# EAGLE schematic what-the-frequency-mk-4 (EAGLE 6.4)
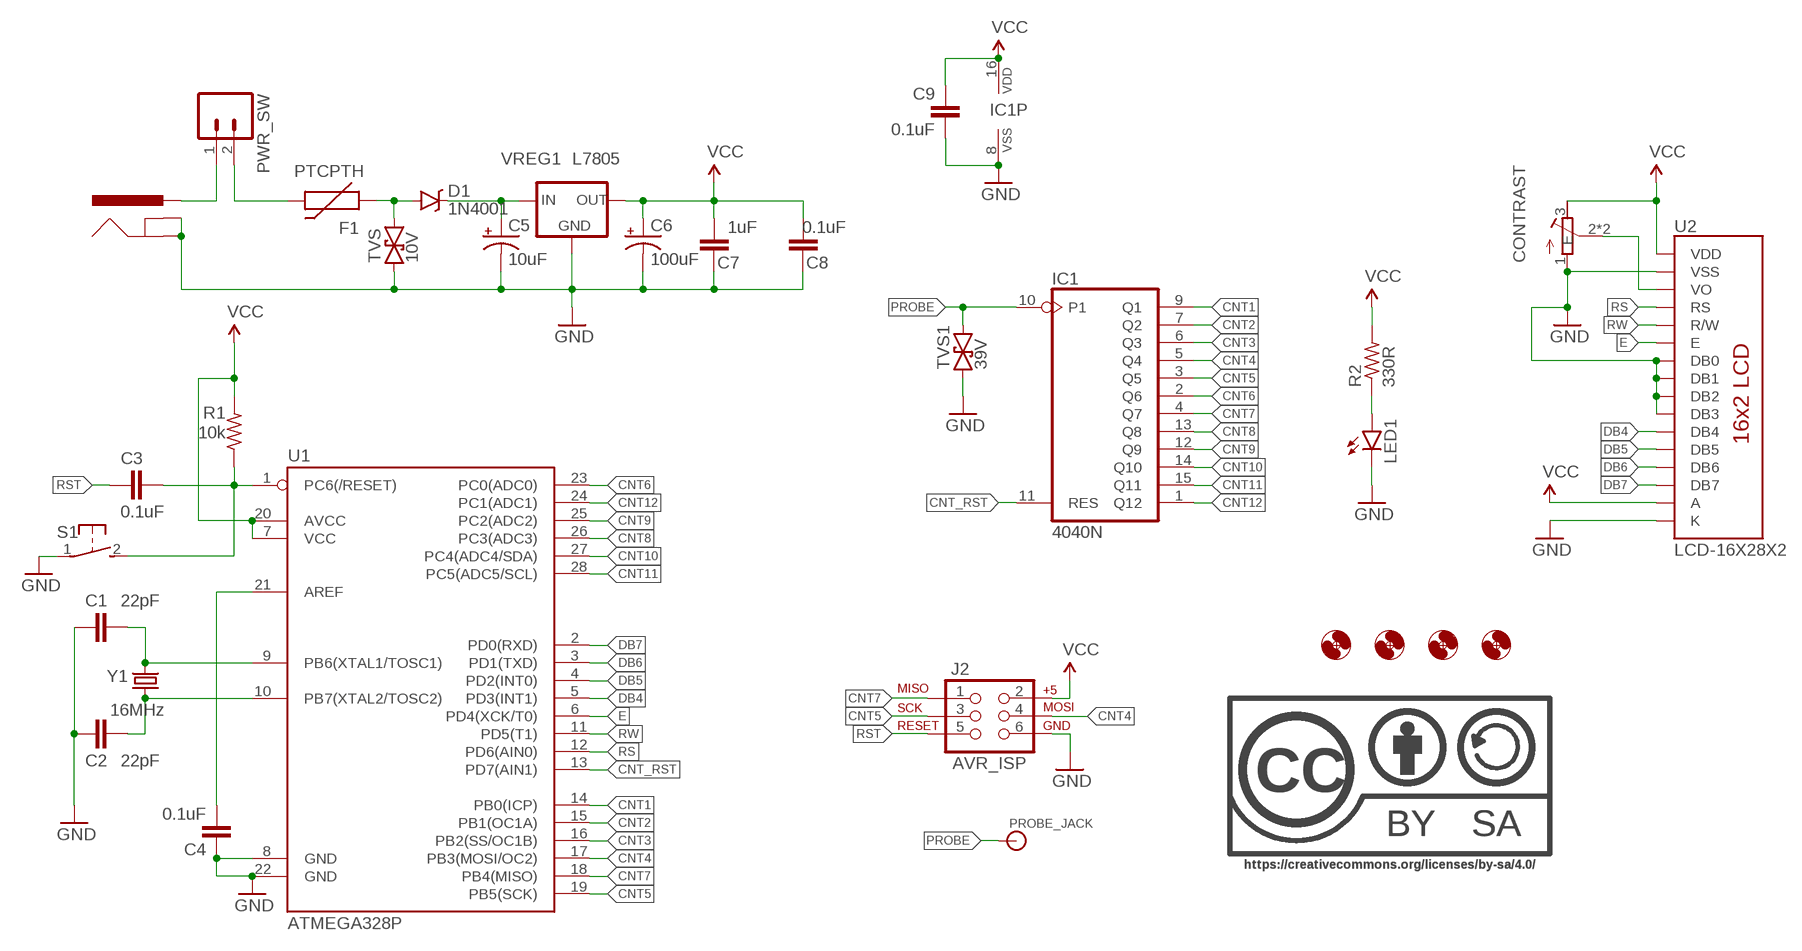
[diagram p0: schematic, sheet 1]

## Parts
C1  22pF  CAPACITOR-CERAMIC025-024X044  [C025-024X044]
C2  22pF  CAPACITOR-CERAMIC025-024X044  [C025-024X044]
C3  0.1uF  CAPACITOR-CERAMIC025-024X044  [C025-024X044]
C4  0.1uF  CAPACITOR-CERAMIC025-024X044  [C025-024X044]
C5  10uF  CAPACITOR-POLARIZEDE2-5  [E2-5]
C6  100uF  CAPACITOR-POLARIZEDE2.5-6  [E2,5-6]
C7  1uF  CAPACITOR-CERAMIC025-024X044  [C025-024X044]
C8  0.1uF  CAPACITOR-CERAMIC025-024X044  [C025-024X044]
C9  0.1uF  CAPACITOR-CERAMIC025-024X044  [C025-024X044]
CONTRAST  POTENTIOMETERTHUMBWHEEL-16MM  [POT-THUMBWHEEL]
D1  1N4001  DIODE-SCHOTTKYDO-41  [DO-41]
F1  PTCPTH  [PTC]
H1  HOLE#4  [HOLE-#4]
H2  HOLE#4  [HOLE-#4]
H3  HOLE#4  [HOLE-#4]
H4  HOLE#4  [HOLE-#4]
IC1  4040N  [DIL16]
J1  POWER_JACKPTH  [POWER_JACK_PTH]
J2  AVR_ISP  AVR_SPI_PRG_6INLINE  [AVR_MINI_PROG]
LED1  LED3MM  [LED3MM]
PROBE_JACK  BANANA_CONNPTH-RA  [BANANA-PTH-RA-SAFEWORD]
PWR_SW  M02PTH  [1X02]
R1  10k  RESISTORAXIAL-PTH-7.68MM  [RESISTOR-AXIAL-PTH-7.68MM]
R2  330R  RESISTORPTH-AXIAL-5.08MM  [RESISTOR-AXIAL-PTH-5.08MM]
S1  DTS-3  [DTS-3]
TVS  10V  TVSDO-41-TVS-BIDIRECTIONAL  [DO-41-TVS]
TVS1  39V  TVSDO-41-TVS-BIDIRECTIONAL  [DO-41-TVS]
U1  ATMEGA328P  ATMEGA328P_PDIP  [DIL28-3]
U2  LCD-16X28X2  [LCD-8X2]
U$3  CC-BY-SA-4.0URL-BOTTOM  [CC-BY-SA-4.0-URL-BOTTOM]
U$7  CC-BY-SA-4.0NO-URL  [CC-BY-SA-4.0-NO-URL]
VREG1  L7805  V_REG_78XXTO-92-INLINE  [TO-92-AMMO]
Y1  16MHz  CRYSTALHC49UV  [HC49U-V]

## Nets
CNT1: IC1.9(Q1) U1.14(PB0(ICP))
CNT2: IC1.7(Q2) U1.15(PB1(OC1A))
CNT3: IC1.6(Q3) U1.16(PB2(SS/OC1B))
CNT4: IC1.5(Q4) J2.4 U1.17(PB3(MOSI/OC2))
CNT5: IC1.3(Q5) J2.3 U1.19(PB5(SCK))
CNT6: IC1.2(Q6) U1.23(PC0(ADC0))
CNT7: IC1.4(Q7) J2.1 U1.18(PB4(MISO))
CNT8: IC1.13(Q8) U1.26(PC3(ADC3))
CNT9: IC1.12(Q9) U1.25(PC2(ADC2))
CNT10: IC1.14(Q10) U1.27(PC4(ADC4/SDA))
CNT11: IC1.15(Q11) U1.28(PC5(ADC5/SCL))
CNT12: IC1.1(Q12) U1.24(PC1(ADC1))
CNT_RST: IC1.11(RES) U1.13(PD7(AIN1))
DB4: U1.5(PD3(INT1)) U2.11(DB4)
DB5: U1.4(PD2(INT0)) U2.12(DB5)
DB6: U1.3(PD1(TXD)) U2.13(DB6)
DB7: U1.2(PD0(RXD)) U2.14(DB7)
E: U1.6(PD4(XCK/T0)) U2.6(E)
GND: C1.2 C2.2 C4.1 C5.- C6.- C7.1 C8.1 C9.1 CONTRAST.1(A) IC1.8(VSS) J1.GND J1.GNDBREAK J2.6 LED1.K(C) S1.1 TVS1.P$1 TVS.P$1 U1.8(GND) U1.22(GND) U2.1(VSS) U2.7(DB0) U2.8(DB1) U2.9(DB2) U2.10(DB3) U2.16(K) VREG1.2(GND)
N$1: C5.+ D1.C VREG1.1(IN)
N$2: LED1.A R2.P$1
N$3: J1.PWR PWR_SW.1
N$4: D1.A F1.P$1 TVS.P$2
N$5: F1.P$2 PWR_SW.2
N$6: C1.1 U1.9(PB6(XTAL1/TOSC1)) Y1.2
N$7: C2.1 U1.10(PB7(XTAL2/TOSC2)) Y1.1
N$8: C4.2 U1.21(AREF)
N$9: CONTRAST.2(S) CONTRAST.2@1(S) U2.3(VO)
N$11: C3.2 R1.P$1 S1.2 U1.1(PC6(/RESET))
PROBE: IC1.10(P1) PROBE_JACK.P$1 PROBE_JACK.P$2 TVS1.P$2
RS: U1.12(PD6(AIN0)) U2.4(RS)
RST: C3.1 J2.5
RW: U1.11(PD5(T1)) U2.5(R/W)
VCC: C6.+ C7.2 C8.2 C9.2 CONTRAST.3(E) IC1.16(VDD) J2.2 R1.P$2 R2.P$2 U1.7(VCC) U1.20(AVCC) U2.2(VDD) U2.15(A) VREG1.3(OUT)

## Library data of the parts
C1-C4 C7-C9 = A_butts:CAPACITOR-CERAMIC: CAPACITOR, European symbol
C5 C6 = A_butts:CAPACITOR-POLARIZED: POLARIZED CAPACITOR, American symbol
CONTRAST = A_butts:POTENTIOMETER: Trimm resistor
D1 = A_butts:DIODE-SCHOTTKY: Schottky diodes in SFE's production catalog BAT20J 1A 23V 0.62Vf RB751 120mA 40V 0.37Vf PMEG4005EJ 0.5A 40V 0.42Vf MBRA140 1A 40V 0.5Vf B340A 3A 40V SMA
F1 = A_butts:PTC: Resettable Fuse PTC Resettable Fuse. Spark Fun Electronics SKU : COM-08357
H1-H4 = A_butts:HOLE: MOUNTING HOLE with drill center marker
IC1 = A_butts:4040: 12-stage binary/ripple COUNTER
J1 = SparkFun-Connectors:POWER_JACK: Power Jack This is the standard 5.5mm barrel jack for power. The PTH is the most common, proven, reliable, footprint. The Slot footprint only works if the mill layer is transmitted to the PCB fab house so be warned. Mating wall wart : TOL-00298 (and others); PROD_ID: PRT-00119
J2 = A_butts:AVR_SPI_PRG_6: AVR ISP 6 Pin This is the reduced ISP connector for AVR programming. Common on Arduino. This footprint will take up less PCB space and can be used with a 10-pin to 6-pin adapter such as SKU: BOB-08508 **Special note about "TEST_POINT" package. The stop mask is on the top side, so if you want your programming test points to be on the bottom of your board, make sure to place this package on the bottom side of the board. This also ensure that the orientation to program from the bottom side will be correct.
LED1 = A_butts:LED: LEDs Standard schematic elements and footprints for 5mm, 3mm, 1206, and 0603 sized LEDs. 5mm - Spark Fun Electronics SKU : COM-00529 (and others)
PROBE_JACK = A_butts:BANANA_CONN: Through-hole banana jack
PWR_SW = A_butts:M02: Standard 2-pin 0.1" header. Use with - straight break away headers ( PRT-00116) - right angle break away headers (PRT-00553) - swiss pins (PRT-00743) - machine pins (PRT-00117) - female headers (PRT-00115) Molex polarized connector foot print use with: PRT-08233 with associated crimp pins and housings. 2.54_SCREWTERM for use with PRT-10571. 3.5mm Screw Terminal footprints for PRT-08084 5mm Screw Terminal footprints for use with PRT-08433
R1 R2 = A_butts:RESISTOR: RESISTOR, American symbol
S1 = switch-tact:DTS-3
TVS TVS1 = A_butts:TVS: Transient voltage suppressor- prevents ESD on inputs. Ignore package description- MBRA140 is NOT this type of part!!!
U1 = SparkFun-DigitalIC:ATMEGA328P_PDIP: uC used in the Arduino 32kb flash, 1k EEPROM, 2k SRAM This is the through-hole version of this chip.
U2 = A_butts:LCD-16X2: Standard text-only 16x2 parallel input LCD
U$3 U$7 = A_butts:CC-BY-SA-4.0
VREG1 = A_butts:V_REG_78XX: Voltage Regulator Standard 7805 5V regulator. IGO (Input Ground Output). Spark Fun Electronics SKU : COM-00107
Y1 = SparkFun-FreqCtrl:CRYSTAL: Various standard crystals. Proven footprints. Spark Fun Electronics SKU : COM-00534